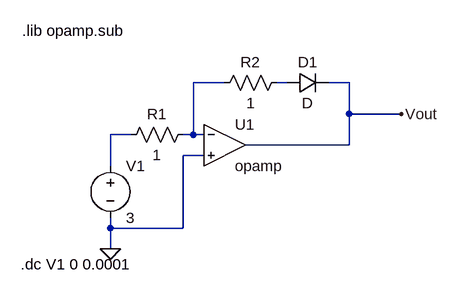
[diagram p0: schematic Logarithm.asc]
Logarithm.asc, the LTspice schematic file:
Version 4
SHEET 1 880 680
WIRE 240 32 192 32
WIRE 336 32 320 32
WIRE 432 32 400 32
WIRE 432 80 432 32
WIRE 512 80 432 80
WIRE 96 112 64 112
WIRE 192 112 192 32
WIRE 192 112 176 112
WIRE 208 112 192 112
WIRE 432 128 432 80
WIRE 432 128 272 128
WIRE 208 144 176 144
WIRE 64 160 64 112
WIRE 64 256 64 240
WIRE 176 256 176 144
WIRE 176 256 64 256
WIRE 64 288 64 256
FLAG 64 288 0
FLAG 512 80 Vout
SYMBOL voltage 64 144 R0
WINDOW 123 0 0 Left 2
WINDOW 39 0 0 Left 2
SYMATTR InstName V1
SYMATTR Value 3
SYMBOL Opamps\\opamp 240 64 R0
SYMATTR InstName U1
SYMBOL res 192 96 R90
WINDOW 0 0 56 VBottom 2
WINDOW 3 32 56 VTop 2
SYMATTR InstName R1
SYMATTR Value 1
SYMBOL res 336 16 R90
WINDOW 0 0 56 VBottom 2
WINDOW 3 32 56 VTop 2
SYMATTR InstName R2
SYMATTR Value 1
SYMBOL diode 336 48 R270
WINDOW 0 32 32 VTop 2
WINDOW 3 0 32 VBottom 2
SYMATTR InstName D1
TEXT -72 -48 Left 2 !.lib opamp.sub
TEXT -74 312 Left 2 !.dc V1 0 0.0001

The netlist it stands for:
* Logarithm.asc
V1 N003 0 3
XU1 N001 0 Vout opamp Aol=100K GBW=10Meg  ; pins invin noninvin out
R1 N001 N003 1
R2 N002 N001 1
D1 N002 Vout D
.model D D
.lib standard.dio
.lib opamp.sub
.dc V1 0 0.0001
.backanno
.end